# EAGLE design VF_Micropower (EAGLE 9.6.2)
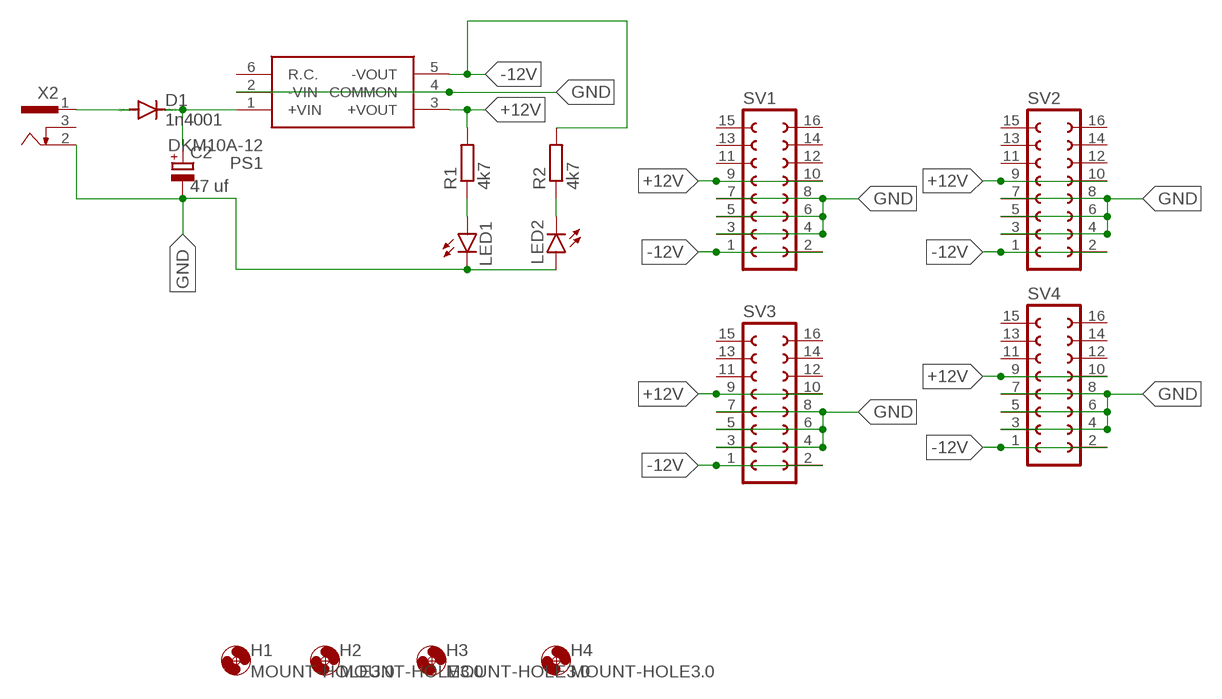
[diagram p0: schematic, sheet 1]

## Parts
C2  47 uf  CPOL-EUE2,5-6E  [E2,5-6E]
D1  1n4001  1N4004  [DO41-10]
H1  MOUNT-HOLE3.0  [3,0]
H2  MOUNT-HOLE3.0  [3,0]
H3  MOUNT-HOLE3.0  [3,0]
H4  MOUNT-HOLE3.0  [3,0]
LED1  LED3MM  [LED3MM]
LED2  LED3MM  [LED3MM]
PS1  DKM10A-12  [SKM10B05]
R1  4k7  R-EU_0207/10  [0207/10]
R2  4k7  R-EU_0207/10  [0207/10]
SV1  FE08-2  [FE08-2]
SV2  FE08-2  [FE08-2]
SV3  FE08-2  [FE08-2]
SV4  FE08-2  [FE08-2]
X2  SCD-014A  [SCD-014-A]

## Nets
+12V: PS1.3(+VOUT) R1.2 SV1.9 SV1.10 SV2.9 SV2.10 SV3.9 SV3.10 SV4.9 SV4.10
-12V: PS1.5(-VOUT) R2.2 SV1.1 SV1.2 SV2.1 SV2.2 SV3.1 SV3.2 SV4.1 SV4.2
GND: C2.- LED1.K(C) LED2.A PS1.2(-VIN) PS1.4(COMMON) SV1.3 SV1.4 SV1.5 SV1.6 SV1.7 SV1.8 SV2.3 SV2.4 SV2.5 SV2.6 SV2.7 SV2.8 SV3.3 SV3.4 SV3.5 SV3.6 SV3.7 SV3.8 SV4.3 SV4.4 SV4.5 SV4.6 SV4.7 SV4.8 X2.2
N$1: C2.+ D1.C PS1.1(+VIN)
N$2: D1.A X2.1
N$3: LED1.A R1.1
N$4: LED2.K(C) R2.1
Unconnected: PS1.6(R.C.) SV1.11 SV1.12 SV1.13 SV1.14 SV1.15 SV1.16 SV2.11 SV2.12 SV2.13 SV2.14 SV2.15 SV2.16 SV3.11 SV3.12 SV3.13 SV3.14 SV3.15 SV3.16 SV4.11 SV4.12 SV4.13 SV4.14 SV4.15 SV4.16 X2.3

## Library data of the parts
C2 = rcl:CPOL-EU: POLARIZED CAPACITOR, European symbol; SPICEPREFIX: C
D1 = diode:1N4004: DIODE general purpose rectifier, 1 A
H1-H4 = holes:MOUNT-HOLE: MOUNTING HOLE with drill center marker
LED1 LED2 = led:LED: LED OSRAM: - CHIPLED LG R971, LG N971, LY N971, LG Q971, LY Q971, LO R971, LY R971 LH N974, LH R974 LS Q976, LO Q976, LY Q976 LO Q996 - Hyper CHIPLED LW Q18S LB Q993, LB Q99A, LB R99A - SideLED LS A670, LO A670, LY A670, LG A670, LP A670 LB A673, LV A673, LT A673, LW A673 LH A674 LY A675 LS A676, LA A676, LO A676, LY A676, LW A676 LS A679, LY A679, LG A679 - Hyper Micro SIDELED® LS Y876, LA Y876, LO Y876, LY Y876 LT Y87S - SmartLED LW L88C, LW L88S LB L89C, LB L89S, LG L890 LS L89K, LO L89K, LY L89K LS L896, LA L896, LO L896, LY L896 - TOPLED LS T670, LO T670, LY T670, LG T670, LP T670 LSG T670, LSP T670, LSY T670, LOP T670, LYG T670 LG T671, LOG T671, LSG T671 LB T673, LV T673, LT T673, LW T673 LH T674 LS T676, LA T676, LO T676, LY T676, LB T676, LH T676, LSB T676, LW T676 LB T67C, LV T67C, LT T67C, LS T67K, LO T67K, LY T67K, LW E67C LS E67B, LA E67B, LO E67B, LY E67B, LB E67C, LV E67C, LT E67C LW T67C LS T679, LY T679, LG T679 LS T770, LO T770, LY T770, LG T770, LP T770 LB T773, LV T773, LT T773, LW T773 LH T774 LS E675, LA E675, LY E675, LS T675 LS T776, LA T776, LO T776, LY T776, LB T776 LHGB T686 LT T68C, LB T68C - Hyper Mini TOPLED® LB M676 - Mini TOPLED Santana® LG M470 LS M47K, LO M47K, LY M47K Source: http://www.osram.convergy.de LUXEON: - LUMILED® LXK2-PW12-R00, LXK2-PW12-S00, LXK2-PW14-U00, LXK2-PW14-V00 LXK2-PM12-R00, LXK2-PM12-S00, LXK2-PM14-U00 LXK2-PE12-Q00, LXK2-PE12-R00, LXK2-PE12-S00, LXK2-PE14-T00, LXK2-PE14-U00 LXK2-PB12-K00, LXK2-PB12-L00, LXK2-PB12-M00, LXK2-PB14-N00, LXK2-PB14-P00, LXK2-PB14-Q00 LXK2-PR12-L00, LXK2-PR12-M00, LXK2-PR14-Q00, LXK2-PR14-R00 LXK2-PD12-Q00, LXK2-PD12-R00, LXK2-PD12-S00 LXK2-PH12-R00, LXK2-PH12-S00 LXK2-PL12-P00, LXK2-PL12-Q00, LXK2-PL12-R00 Source: www.luxeon.com KINGBRIGHT: KA-3528ASYC Source: www.kingbright.com
PS1 = DKM10A-12:DKM10A-12: Isolated DC/DC Converters 9-18Vin +/-12Vout +/-416mA DIP Iso Reg Source: Datasheet <http://www.meanwellusa.com/productPdf.aspx?i=799>; DESCRIPTION: Isolated DC/DC Converters 9-18Vin +/-12Vout +/-416mA DIP Iso Reg; HEIGHT: 10mm; MANUFACTURER_NAME: Mean Well; MANUFACTURER_PART_NUMBER: DKM10A-12; MOUSER_PART_NUMBER: 709-DKM10A-12; MOUSER_PRICE-STOCK: https://www.mouser.co.uk/ProductDetail/MEAN-WELL/DKM10A-12?qs=5aG0NVq1C4w4nILNzTqi1g%3D%3D
R1 R2 = rcl:R-EU_: RESISTOR, European symbol; SPICEPREFIX: R
SV1-SV4 = con-lsta:FE08-2: FEMALE HEADER; OC_FARNELL: unknown; OC_NEWARK: unknown
X2 = con-shiua-chyuan:SCD-014A: Power Jack 2.5mm; OC_FARNELL: unknown; OC_NEWARK: unknown

## Board
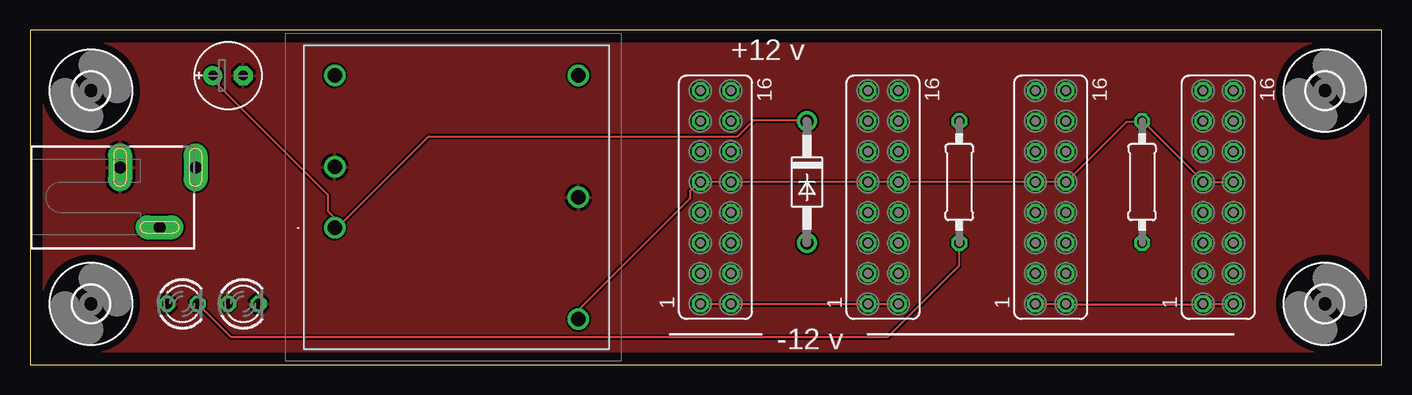
[diagram p1: board, top side]
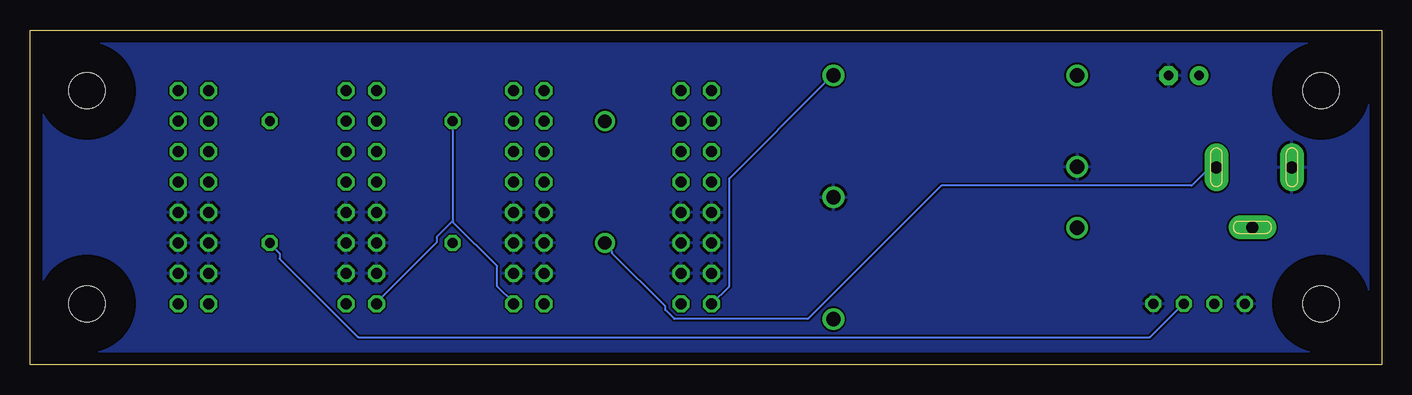
[diagram p2: board, bottom side, seen from below]

Size 112.7 x 27.93 mm. Coordinates in mm from the lower left corner, seen from the top.
Outline: 0,0 112.7,0 112.7,27.93 0,27.93 0,0
Copper layers (1*16): Top 0.035mm / dielectric 1.5mm / Bottom 0.035mm
Design rules "default": minimum track width 6mil, minimum drill 0.35mm, track to track 6mil, track to pad 6mil, pad to pad 6mil, via to via 6mil, smd to smd 6mil, copper to edge 40mil, drill to drill 6mil, minimum pad ring 10mil, minimum via ring 8mil, stop-mask expansion 4mil, vias tented up to drill 0mil, thermal gap 10mil

### Footprints (pad centres in the part's own frame; a part is rotated, then mirrored left to right if it is on the bottom)
E2,5-6E = drill 0.813 pad 1.575: + -1.27,0 | drill 0.813 pad 1.575 octagon: - 1.27,0
DO41-10 = drill 1.118: A 5.08,0; C -5.08,0
3,0 = hole 3: 0,0
LED3MM = drill 0.813 octagon: A -1.27,0; K 1.27,0
SKM10B05 = drill 1.2 pad 1.8: 1 -2.54,10.16; 2 2.54,10.16; 3 -10.16,-10.16; 4 0,-10.16; 5 10.16,-10.16; 6 10.16,10.16
0207/10 = drill 0.813 octagon: 1 -5.08,0; 2 5.08,0
FE08-2 = drill 0.914 octagon: 1 -8.89,1.27; 2 -8.89,-1.27; 3 -6.35,1.27; 4 -6.35,-1.27; 5 -3.81,1.27; 6 -3.81,-1.27; 7 -1.27,1.27; 8 -1.27,-1.27; 9 1.27,1.27; 10 1.27,-1.27; 11 3.81,1.27; 12 3.81,-1.27; 13 6.35,1.27; 14 6.35,-1.27; 15 8.89,1.27; 16 8.89,-1.27
SCD-014-A = drill 1 pad 2 long: 1 -2.5,13.8; 2 -2.5,7.5; 3 2.5,10.8

### Placement (x,y rotation side)
C2  16.51,24.13 0 top
D1  64.77,15.24 270 top
H1  5.08,22.86 0 top
H2  5.08,5.08 0 top
H3  107.95,22.86 0 top
H4  107.95,5.08 0 top
LED1  17.78,5.08 0 top
LED2  12.7,5.08 0 top
PS1  35.56,13.97 90 top
R1  92.71,15.24 90 top
R2  77.47,15.24 90 top
SV1  57.15,13.97 90 top
SV2  71.12,13.97 90 top
SV3  85.09,13.97 90 top
SV4  99.06,13.97 90 top
X2  0,13.97 270 top

### Tracks (layer width: path | path; a pad name or v marks a point on that pad's centre or on a via)
+12V
  Top 0.152: PS1.3 45.72,4.57 55.02,13.87 55.02,14.48 55.78,15.24 SV1.9 SV1.10 SV2.9 SV2.10 SV3.9 SV3.10 86.41,15.24 91.44,20.27 92.66,20.27 R1.2 92.81,20.27 97.84,15.24 | 97.84,15.24 SV4.10 | 97.84,15.24 SV4.9
-12V
  Top 0.152: SV1.1 55.93,5.03 58.37,5.03 SV1.2 58.52,5.03 69.8,5.03 SV2.1 69.95,5.03 72.39,5.03 SV2.2 | SV4.2 100.28,5.03 97.84,5.03 SV4.1 97.69,5.03 86.41,5.03 SV3.2 86.26,5.03 83.82,5.03 SV3.1
  Bottom 0.152: SV1.1 54.41,6.55 54.41,15.54 46.33,23.62 46.18,23.62 45.72,24.08 PS1.5 | 77.42,12.04 77.42,11.89 73.76,8.23 73.76,6.55 72.39,5.18 SV2.2 | 77.42,12.04 77.42,20.27 R2.2 | 77.42,12.04 78.79,10.67 78.79,10.21 83.82,5.18 SV3.1
GND
  pour Top: 0,0 0,27.94 113.03,27.94 113.03,0
  pour Bottom: 0,0 0,27.94 113.03,27.94 113.03,0
N$1
  Top 0.152: C2.+ 15.24,23.77 24.84,14.17 24.84,12.8 25.3,12.34 25.3,11.89 | 25.3,11.89 25.3,11.43 PS1.1 25.3,11.89 | 25.3,11.89 26.06,11.89 33.22,19.05 58.98,19.05 60.35,20.42 64.77,20.42 D1.C
N$2
  Bottom 0.152: D1.A 64.77,10.06 64.16,9.45 64.16,9.3 59.74,4.88 59.74,4.57 58.98,3.81 47.85,3.81 36.73,14.94 15.85,14.94 14.33,16.46 13.87,16.46 X2.1
N$3
  Bottom 0.152: LED1.A 16.61,5.03 19.36,2.29 85.34,2.29 91.9,8.84 91.9,9.3 92.66,10.06 R1.1
N$4
  Top 0.152: LED2.K 16.76,2.29 71.48,2.29 77.42,8.23 77.42,10.06 R2.1

### Text on the board
tPlace: +12 v | -12 v
tValues: Mean Well | 1n4001 | VF | DKM10A-12 | - to Right